# Altium schematic sheet Asfaloth_L2_AVI_ver0.0.SchDoc
size A3
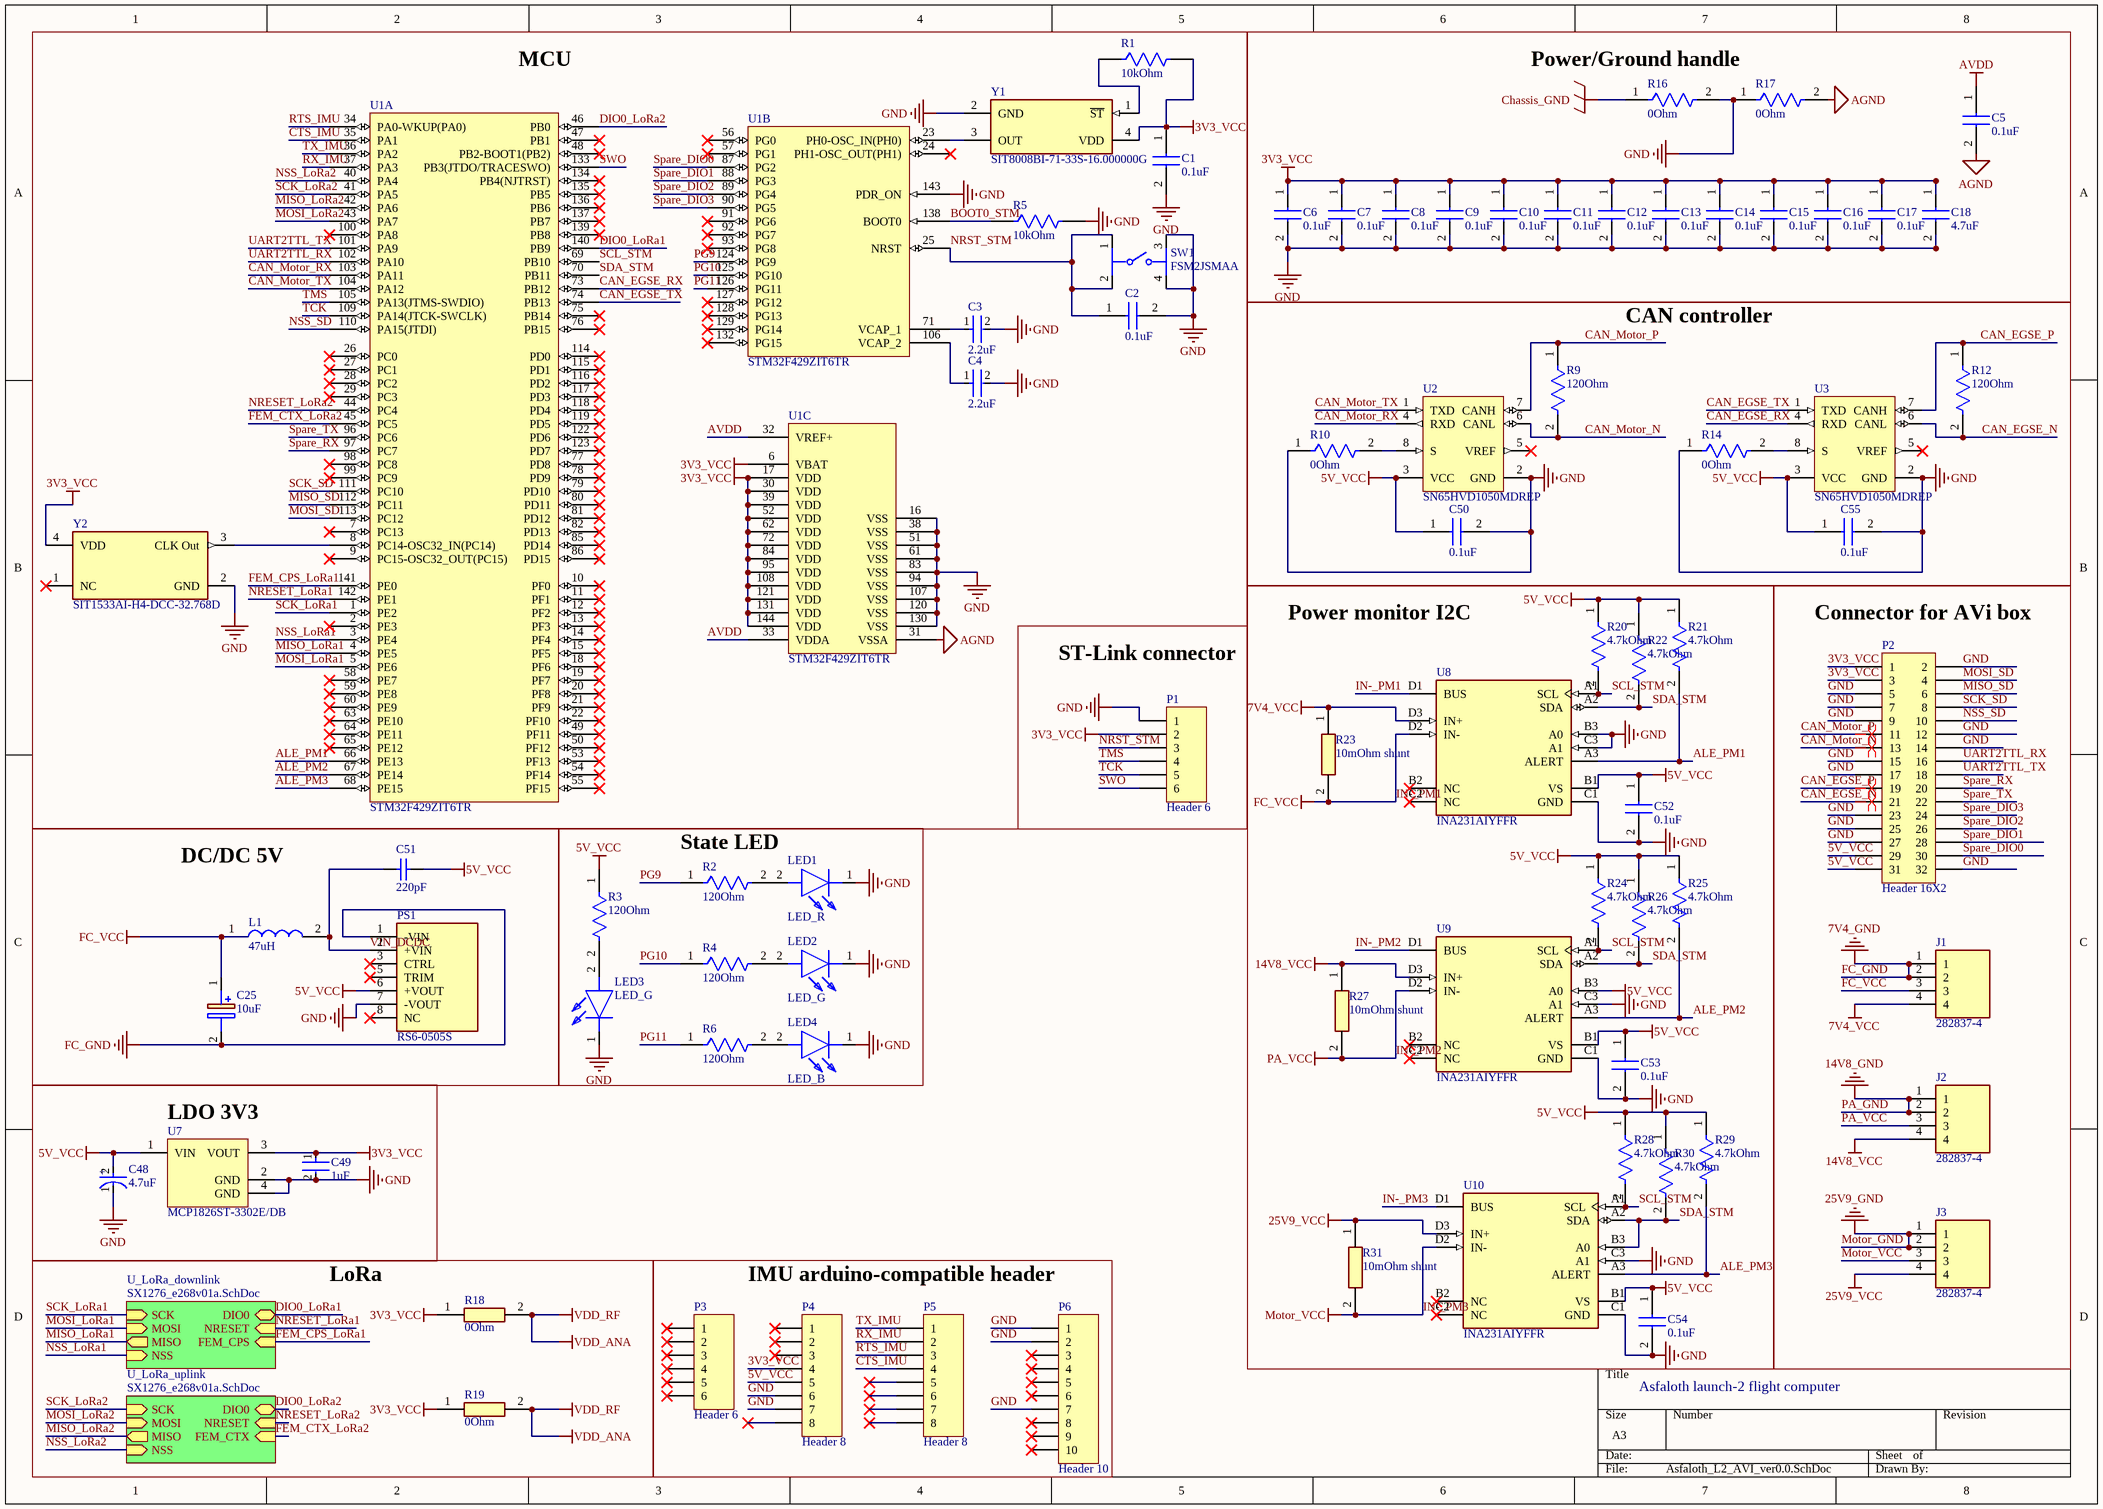
[diagram p0: Asfaloth_L2_AVI_ver0.0.SchDoc]

## Parts
C1  0.1uF  [CAPC1608X87N]
C2  0.1uF  [CAPC1608X87N]
C3  2.2uF  [FP-GRT155-0_2-IPC_C]
C4  2.2uF  [FP-GRT155-0_2-IPC_C]
C5  0.1uF  [CAPC1608X87N]
C6  0.1uF  [CAPC1608X87N]
C7  0.1uF  [CAPC1608X87N]
C8  0.1uF  [CAPC1608X87N]
C9  0.1uF  [CAPC1608X87N]
C10  0.1uF  [CAPC1608X87N]
C11  0.1uF  [CAPC1608X87N]
C12  0.1uF  [CAPC1608X87N]
C13  0.1uF  [CAPC1608X87N]
C14  0.1uF  [CAPC1608X87N]
C15  0.1uF  [CAPC1608X87N]
C16  0.1uF  [CAPC1608X87N]
C17  0.1uF  [CAPC1608X87N]
C18  4.7uF  [GRT188]
C25  10uF  [CAPAE830X650N]
C48  4.7uF  [FP-TAJA-MFG]
C49  1uF  [FP-GCM21B-0_15-MFG]
C50  0.1uF  [CAPC1608X87N]
C51  220pF  [CAPC1608X87X35LL15T15]
C52  0.1uF  [CAPC1608X87N]
C53  0.1uF  [CAPC1608X87N]
C54  0.1uF  [CAPC1608X87N]
C55  0.1uF  [CAPC1608X87N]
J1  282837-4  [2828374]
J2  282837-4  [2828374]
J3  282837-4  [2828374]
L1  47uH  [SRR5228A]
LED1  LED_R  [LEDC2012X80N]
LED2  LED_G  [LEDC2012X90N]
LED3  LED_G  [LEDC2012X90N]
LED4  LED_B  [LEDM2012X100N]
P1  Header 6  [HDR1X6]
P2  Header 16X2  [HDR2X16]
P3  Header 6  [HDR1X6]
P4  Header 8  [HDR1X8]
P5  Header 8  [HDR1X8]
P6  Header 10  [HDR1X10]
PS1  RS6-0505S  [RS60505S]
R1  10kOhm  [FP-CRCW0805-e3-IPC_A]
R2  120Ohm  [FP-ERJ2RK-MFG]
R3  120Ohm  [FP-ERJ2RK-MFG]
R4  120Ohm  [FP-ERJ2RK-MFG]
R5  10kOhm  [FP-CRCW0805-e3-IPC_A]
R6  120Ohm  [FP-ERJ2RK-MFG]
R9  120Ohm  [FP-ERJ2RK-MFG]
R10  0Ohm  [FP-AC0603-0_55-IPC_A]
R12  120Ohm  [FP-ERJ2RK-MFG]
R14  0Ohm  [FP-AC0603-0_55-IPC_A]
R16  0Ohm  [FP-AC0603-0_55-IPC_A]
R17  0Ohm  [FP-AC0603-0_55-IPC_A]
R18  0Ohm  [RESC3216X60N]
R19  0Ohm  [RESC3216X60N]
R20  4.7kOhm  [FP-KTR03-IPC_C]
R21  4.7kOhm  [FP-KTR03-IPC_C]
R22  4.7kOhm  [FP-KTR03-IPC_C]
R23  10mOhm shunt  [CSS0805FT10L0]
R24  4.7kOhm  [FP-KTR03-IPC_C]
R25  4.7kOhm  [FP-KTR03-IPC_C]
R26  4.7kOhm  [FP-KTR03-IPC_C]
R27  10mOhm shunt  [CSS0805FT10L0]
R28  4.7kOhm  [FP-KTR03-IPC_C]
R29  4.7kOhm  [FP-KTR03-IPC_C]
R30  4.7kOhm  [FP-KTR03-IPC_C]
R31  10mOhm shunt  [CSS0805FT10L0]
SW1  FSM2JSMAA  [FP-FSM2JSMAA-MFG]
U1  STM32F429ZIT6TR  [STM-LQFP144_M]  (parts A,B,C of 3)
U2  SN65HVD1050MDREP  [D0008A_M]
U3  SN65HVD1050MDREP  [D0008A_M]
U7  MCP1826ST-3302E/DB  [SOT-223-DB3_L]
U8  INA231AIYFFR  [FP-YFF0012-IPC_C]
U9  INA231AIYFFR  [FP-YFF0012-IPC_C]
U10  INA231AIYFFR  [FP-YFF0012-IPC_C]
Y1  SIT8008BI-71-33S-16.000000G  [FP-SiT8008-7-MFG]
Y2  SIT1533AI-H4-DCC-32.768D  [FP-SiT1533-H-MFG]

## Blocks framed on the sheet
MCU: C1-C4 R1 R5 SW1 U1 Y1 Y2
Power/Ground handle: C5-C18 R16 R17
CAN controller: C50 C55 R9 R10 R12 R14 U2 U3
Power monitor I2C: C52-C54 R20-R31 U8-U10
Connector for AVi box: J1-J3 P2
ST-Link connector: P1
DC/DC 5V: C25 C51 L1 PS1
State LED: LED1-LED4 R2-R4 R6
LDO 3V3: C48 C49 U7
LoRa: R18 R19
IMU arduino-compatible header: P3-P6

## Sub-sheets
U_LoRa_downlink = SX1276_e268v01a.SchDoc: SCK (in), MOSI (in), MISO (out), NSS (in), DIO0 (bidir), NRESET (in), FEM_CPS (in)
U_LoRa_uplink = SX1276_e268v01a.SchDoc: SCK (in), MOSI (in), MISO (out), NSS (in), DIO0 (bidir), NRESET (in), FEM_CTX (in)

## Nets
3V3_VCC: C1.1 C6.1 C7.1 C8.1 C9.1 C10.1 C11.1 C12.1 C13.1 C14.1 C15.1 C16.1 C17.1 C18.1 C49.1 P1.2 P2.1 P2.3 P4.4 R1.2 R18.1 R19.1 U1.6(VBAT) U1.17(VDD) U1.30(VDD) U1.39(VDD) U1.52(VDD) U1.62(VDD) U1.72(VDD) U1.84(VDD) U1.95(VDD) U1.108(VDD) U1.121(VDD) U1.131(VDD) U1.144(VDD) U7.3(VOUT) Y1.4(VDD) Y2.4(VDD)
5V_VCC: C48.2(A) C50.1 C51.2 C52.1 C53.1 C54.1 C55.1 P2.29 P2.31 P4.5 PS1.6(+VOUT) R3.1 R20.1 R21.1 R22.1 R24.1 R25.1 R26.1 R28.1 R29.1 R30.1 U2.3(VCC) U3.3(VCC) U7.1(VIN) U8.B1(VS) U9.B1(VS) U9.B3(A0) U10.B1(VS)
7V4_VCC: J1.4 R23.1 U8.D3(IN+)
14V8_VCC: J2.4 R27.1 U9.D3(IN+)
25V9_VCC: J3.4 R31.1 U10.D3(IN+)
AGND: C5.2 R17.2 U1.31(VSSA)
AVDD: C5.1 U1.32(VREF+) U1.33(VDDA)
Chassis_GND: R16.1
FC_GND: C25.2(-) J1.1 J1.2 PS1.1(-VIN)  [also labelled 7V4_GND]
FC_VCC: C25.1(+) J1.3 L1.1 R23.2 U8.D1(BUS) U8.D2(IN-)  [also labelled IN-_PM1]
GND: C1.2 C2.2 C3.2 C4.2 C6.2 C7.2 C8.2 C9.2 C10.2 C11.2 C12.2 C13.2 C14.2 C15.2 C16.2 C17.2 C18.2 C48.1(C) C49.2 C50.2 C52.2 C53.2 C54.2 C55.2 LED1.1(K) LED2.1(K) LED3.1(K) LED4.1(K) P1.1 P2.2 P2.5 P2.7 P2.9 P2.12 P2.14 P2.15 P2.17 P2.23 P2.25 P2.27 P2.32 P4.6 P4.7 P6.1 P6.2 P6.7 PS1.7(-VOUT) R5.2 R10.1 R14.1 R16.2 R17.1 SW1.3 SW1.4 U1.16(VSS) U1.38(VSS) U1.51(VSS) U1.61(VSS) U1.83(VSS) U1.94(VSS) U1.107(VSS) U1.120(VSS) U1.130(VSS) U1.143(PDR_ON) U2.2(GND) U3.2(GND) U7.2(GND) U7.4(GND) U8.B3(A0) U8.C1(GND) U8.C3(A1) U9.C1(GND) U9.C3(A1) U10.C1(GND) U10.C3(A1) Y1.2(GND) Y2.2(GND)
IN-_PM2: J2.3 R27.2 U9.D1(BUS) U9.D2(IN-)  [also labelled PA_VCC]
IN-_PM3: J3.3 R31.2 U10.D1(BUS) U10.D2(IN-)  [also labelled Motor_VCC]
Motor_GND: J3.1 J3.2  [also labelled 25V9_GND]
PA_GND: J2.1 J2.2  [also labelled 14V8_GND]
VDD_ANA: R18.2 R19.2  [also labelled VDD_RF]
ALE_PM1: R21.2 U1.66(PE13) U8.A3(ALERT)
ALE_PM2: R25.2 U1.67(PE14) U9.A3(ALERT)
ALE_PM3: R29.2 U1.68(PE15) U10.A3(ALERT)
BOOT0_STM: R5.1 U1.138(BOOT0)
CAN_EGSE_N: P2.21 R12.2 U3.6(CANL)
CAN_EGSE_P: P2.19 R12.1 U3.7(CANH)
CAN_EGSE_RX: U1.73(PB12) U3.4(RXD)
CAN_EGSE_TX: U1.74(PB13) U3.1(TXD)
CAN_Motor_N: P2.13 R9.2 U2.6(CANL)
CAN_Motor_P: P2.11 R9.1 U2.7(CANH)
CAN_Motor_RX: U1.103(PA11) U2.4(RXD)
CAN_Motor_TX: U1.104(PA12) U2.1(TXD)
CTS_IMU: P5.4 U1.35(PA1)
DIO0_LoRa1: U1.140(PB9) ; sheet U_LoRa_downlink/DIO0
DIO0_LoRa2: U1.46(PB0) ; sheet U_LoRa_uplink/DIO0
FEM_CPS_LoRa1: U1.141(PE0) ; sheet U_LoRa_downlink/FEM_CPS
FEM_CTX_LoRa2: U1.45(PC5) ; sheet U_LoRa_uplink/FEM_CTX
MISO_LoRa1: U1.4(PE5) ; sheet U_LoRa_downlink/MISO
MISO_LoRa2: U1.42(PA6) ; sheet U_LoRa_uplink/MISO
MISO_SD: P2.6 U1.112(PC11)
MOSI_LoRa1: U1.5(PE6) ; sheet U_LoRa_downlink/MOSI
MOSI_LoRa2: U1.43(PA7) ; sheet U_LoRa_uplink/MOSI
MOSI_SD: P2.4 U1.113(PC12)
NRESET_LoRa1: U1.142(PE1) ; sheet U_LoRa_downlink/NRESET
NRESET_LoRa2: U1.44(PC4) ; sheet U_LoRa_uplink/NRESET
NRST_STM: C2.1 P1.3 SW1.1 SW1.2 U1.25(NRST)
NSS_LoRa1: U1.3(PE4) ; sheet U_LoRa_downlink/NSS
NSS_LoRa2: U1.40(PA4) ; sheet U_LoRa_uplink/NSS
NSS_SD: P2.10 U1.110(PA15(JTDI))
PG9: R2.1 U1.124(PG9)
PG10: R4.1 U1.125(PG10)
PG11: R6.1 U1.126(PG11)
RTS_IMU: P5.3 U1.34(PA0-WKUP(PA0))
RX_IMU: P5.2 U1.37(PA3)
SCK_LoRa1: U1.1(PE2) ; sheet U_LoRa_downlink/SCK
SCK_LoRa2: U1.41(PA5) ; sheet U_LoRa_uplink/SCK
SCK_SD: P2.8 U1.111(PC10)
SCL_STM: R20.2 R24.2 R28.2 U1.69(PB10) U8.A1(SCL) U9.A1(SCL) U10.A1(SCL)
SDA_STM: R22.2 R26.2 R30.2 U1.70(PB11) U8.A2(SDA) U9.A2(SDA) U10.A2(SDA) U10.B3(A0)
Spare_DIO0: P2.30 U1.87(PG2)
Spare_DIO1: P2.28 U1.88(PG3)
Spare_DIO2: P2.26 U1.89(PG4)
Spare_DIO3: P2.24 U1.90(PG5)
Spare_RX: P2.20 U1.97(PC7)
Spare_TX: P2.22 U1.96(PC6)
SWO: P1.6 U1.133(PB3(JTDO/TRACESWO))
TCK: P1.5 U1.109(PA14(JTCK-SWCLK))
TMS: P1.4 U1.105(PA13(JTMS-SWDIO))
TX_IMU: P5.1 U1.36(PA2)
UART2TTL_RX: P2.16 U1.102(PA10)
UART2TTL_TX: P2.18 U1.101(PA9)
VIN_DCDC: C51.1 L1.2 PS1.2(+VIN)
NetC3_1: C3.1 U1.71(VCAP_1)
NetC4_1: C4.1 U1.106(VCAP_2)
NetLED1_2: LED1.2(A) R2.2
NetLED2_2: LED2.2(A) R4.2
NetLED3_2: LED3.2(A) R3.2
NetLED4_2: LED4.2(A) R6.2
NetR1_1: R1.1 Y1.1(~{ST})
NetR10_2: R10.2 U2.8(S)
NetR14_2: R14.2 U3.8(S)
NetU1_8: U1.8(PC14-OSC32_IN(PC14)) Y2.3(CLK_Out)
NetU1_23: U1.23(PH0-OSC_IN(PH0)) Y1.3(OUT)

Not connected (* = marked no-connect by the designer): P3 1* 2* 3* 4* 5* 6*; P4 1* 2* 3* 8*; P5 5* 6* 7* 8*; P6 3* 4* 5* 6* 8* 9* 10*; PS1 3(CTRL)* 5(TRIM)* 8(NC)*; U1 2(PE3)* 7(PC13)* 9(PC15-OSC32_OUT(PC15))* 10(PF0)* 11(PF1)* 12(PF2)* 13(PF3)* 14(PF4)* 15(PF5)* 18(PF6)* 19(PF7)* 20(PF8)* 21(PF9)* 22(PF10)* 24(PH1-OSC_OUT(PH1))* 26(PC0)* 27(PC1)* 28(PC2)* 29(PC3)* 47(PB1)* 48(PB2-BOOT1(PB2))* 49(PF11)* 50(PF12)* 53(PF13)* 54(PF14)* 55(PF15)* 56(PG0)* 57(PG1)* 58(PE7)* 59(PE8)* 60(PE9)* 63(PE10)* 64(PE11)* 65(PE12)* 75(PB14)* 76(PB15)* 77(PD8)* 78(PD9)* 79(PD10)* 80(PD11)* 81(PD12)* 82(PD13)* 85(PD14)* 86(PD15)* 91(PG6)* 92(PG7)* 93(PG8)* 98(PC8)* 99(PC9)* 100(PA8)* 114(PD0)* 115(PD1)* 116(PD2)* 117(PD3)* 118(PD4)* 119(PD5)* 122(PD6)* 123(PD7)* 127(PG12)* 128(PG13)* 129(PG14)* 132(PG15)* 134(PB4(NJTRST))* 135(PB5)* 136(PB6)* 137(PB7)* 139(PB8)*; U2 5(VREF)*; U3 5(VREF)*; U8 B2(NC)* C2(NC)*; U9 B2(NC)* C2(NC)*; U10 B2(NC)* C2(NC)*; Y2 1(NC)*

## Layout directives
differential pair: CAN_EGSE_N, CAN_EGSE_P, CAN_Motor_N, CAN_Motor_P

## Notes on the sheet
- Asfaloth launch-2 flight computer
- (in symbol CMP-2100-03687-2) +

## Library data of the parts
C1 C2 C5-C17 C50 C52-C55 = C0603C104J4RECAUTO: Capacitor; Manufacturer_Name: KEMET; Datasheet Link: https://content.kemet.com/datasheets/KEM_C1090_X7R_ESD.pdf; Height: 0.87mm; Manufacturer_Part_Number: C0603C104J4RECAUTO; Mouser Part Number: 80-C0603C104J4RECAUT; Mouser Price/Stock: https://www.mouser.co.uk/ProductDetail/KEMET/C0603C104J4RECAUTO?qs=MLItCLRbWswpTgrKtA5UXg%3D%3D
C3 C4 = CMP-06035-008228-1: Multi-Layer Ceramic Capacitor 2.2uF 10V X6S ±10% 0402 Paper T/R; Case Code (Imperial): 0402; Max Operating Temperature: 105°C; Width: 0.02inch; Thickness: 0.022inch; Ratings: AEC-Q200; Mount: Surface Mount; Voltage Rating (DC): 10V; Capacitance: 2.2uF; Voltage Rating: 10V; Dielectric: X6S; Packaging: Tape and Reel; Case/Package: 0402; Case Code (Metric): 1005; Tolerance: 10%; Min Operating Temperature: -55°C; Length: 0.039inch
C18 = GRT188C71C475KE13D: Capacitor; Manufacturer_Name: Murata Electronics; Datasheet Link: https://www.murata.com/en-global/products/productdetail?partno=GRT188C71C475KE13%23; Height: 0.8mm; Manufacturer_Part_Number: GRT188C71C475KE13D; Mouser Part Number: 81-GRT188C71C475KE13; Mouser Price/Stock: https://www.mouser.co.uk/ProductDetail/Murata-Electronics/GRT188C71C475KE13D?qs=pUKx8fyJudC7lYX%252BQNKS7Q%3D%3D; Arrow Part Number: GRT188C71C475KE13D; Arrow Price/Stock: https://www.arrow.com/en/products/grt188c71c475ke13d/murata-manufacturing?region=nac
C25 = EEE-TG1J100P: Capacitor Polarised; Manufacturer_Name: Panasonic; Datasheet Link: http://industrial.panasonic.com/cdbs/www-data/pdf/RDE0000/ABA0000C1187.pdf; Height: 6.5mm; Manufacturer_Part_Number: EEE-TG1J100P; Mouser Part Number: 667-EEE-TG1J100P; Mouser Price/Stock: https://www.mouser.co.uk/ProductDetail/Panasonic/EEE-TG1J100P?qs=aAAGLDy8P2x3htHP%2FTxLDQ%3D%3D; Arrow Part Number: EEE-TG1J100P; Arrow Price/Stock: https://www.arrow.com/en/products/eee-tg1j100p/panasonic; Supplier 1: Mouser; Supplier Part Number 1: 667-EEE-TG1J100P
C48 = CMP-2100-03687-2: 4.7uF 16V  ±10% 4Ω 1206  SMD Tantalum Capacitor; Leakage Current: 800nA; ESR (Equivalent Series Resistance): 4R; Dissipation Factor: 6%; Polarity: Polar; Number of Pins: 2; Case Code (Metric): 3216; Dielectric Material: Tantalum; REACH SVHC: No SVHC; Height: 1.6mm; Lead Pitch: 1.1mm; Tolerance: 10%; Voltage Rating (DC): 16V; Features: General Purpose; Case Code (Imperial): 1206; Packaging: Tape and Reel; Termination: SMD/SMT; Capacitance: 4.7uF; Voltage: 16V; Case/Package: 1206; Length: 3.2mm; Max Operating Temperature: 125°C; Depth: 1.6mm; Height - Seated (Max): 0.071inch; Series: TAJ; Mount: Surface Mount; Package Quantity: 1; Radiation Hardening: No; Voltage Rating: 16V; Min Operating Temperature: -55°C; Lead Free: Lead Free; RoHS Compliant: Yes; Width: 1.6mm; Construction: Flat
C49 = CMP-06035-047787-1: Ceramic Capacitor for Automotive 1uF ±10% 16VDC X7R 0805 Embossed T/R; Voltage Rating (DC): 16V; Capacitance: 1uF; Case/Package: 0805; Dielectric: X7R; Depth: 1.25mm; Min Operating Temperature: -55°C; Max Operating Temperature: 125°C; Packaging: Tape and Reel; Length: 2mm; Tolerance: 10%
C51 = CMP-2006-03337-1: Part Number: C0603C221J5GACAUTO; Manufacturer: Kemet
J1-J3 = 282837-4: Connector; Manufacturer_Name: TE Connectivity; Datasheet Link: https://www.te.com/commerce/DocumentDelivery/DDEController?Action=srchrtrv&DocNm=1-1773458-1_EURO_STYLE_QRG&DocType=Data%20Sheet&DocLang=English&PartCntxt=282837-4&DocFormat=pdf; Height: 10.3mm; Manufacturer_Part_Number: 282837-4; Mouser Part Number: 571-2828374; Mouser Price/Stock: https://www.mouser.co.uk/ProductDetail/TE-Connectivity/282837-4?qs=A%252Bip%252BNCYi6MiQzbqNH27Ug%3D%3D; Arrow Part Number: 282837-4; Arrow Price/Stock: https://www.arrow.com/en/products/282837-4/te-connectivity?region=nac
L1 = SRR5228A-470M: Inductor; Manufacturer_Name: Bourns; Datasheet Link: https://www.bourns.com/docs/Product-Datasheets/SRR5228A.pdf; Manufacturer_Part_Number: SRR5228A-470M; Mouser Part Number: 6521-SRR5228A-470M; Mouser Price/Stock: https://www.mouser.co.uk/ProductDetail/Bourns/SRR5228A-470M?qs=QpmGXVUTftG9kA8o879uEQ%3D%3D; Supplier 1: Mouser; Supplier Part Number 1: 6521-SRR5228A-470M
LED1 = SML-H12V8TT86C: LED; Manufacturer_Name: ROHM Semiconductor; Datasheet Link: https://www.mouser.in/ProductDetail/ROHM-Semiconductor/SML-H12V8TT86C?qs=HXFqYaX1Q2xM3o6aiCqz5g%3D%3D; Height: 0.8mm; Manufacturer_Part_Number: SML-H12V8TT86C; Mouser Part Number: 755-SML-H12V8TT86C; Mouser Price/Stock: https://www.mouser.co.uk/ProductDetail/ROHM-Semiconductor/SML-H12V8TT86C?qs=HXFqYaX1Q2xM3o6aiCqz5g%3D%3D
LED2 LED3 = SML-H12P8TT86C: LED; Manufacturer_Name: ROHM Semiconductor; Datasheet Link: https://mouser.componentsearchengine.com/Datasheets/2/SML-H12P8TT86C.pdf; Height: 0.9mm; Manufacturer_Part_Number: SML-H12P8TT86C; Mouser Part Number: 755-SML-H12P8TT86C; Mouser Price/Stock: https://www.mouser.co.uk/ProductDetail/ROHM-Semiconductor/SML-H12P8TT86C?qs=HXFqYaX1Q2xINkpk%2F8IQZg%3D%3D
LED4 = SMLMN2BCTT86C: LED; Manufacturer_Name: ROHM Semiconductor; Datasheet Link: https://fscdn.rohm.com/en/products/databook/datasheet/opto/led/chip_mono/smlmn2bctt86(c)-e.pdf; Height: 1mm; Manufacturer_Part_Number: SMLMN2BCTT86C; Mouser Part Number: 755-SMLMN2BCTT86C; Mouser Price/Stock: https://www.mouser.co.uk/ProductDetail/ROHM-Semiconductor/SMLMN2BCTT86C?qs=EAJhGnHnT02MwYNfU4gt9w%3D%3D; Arrow Part Number: SMLMN2BCTT86C; Arrow Price/Stock: https://www.arrow.com/en/products/smlmn2bctt86c/rohm-semiconductor
P1 P3 = Header 6: Header, 6-Pin; LatestRevisionDate: 17-Jul-2002; LatestRevisionNote: Re-released for DXP Platform.; Publisher: Altium Limited
P2 = Header 16X2: Header, 16-Pin, Dual row; LatestRevisionDate: 17-Jul-2002; LatestRevisionNote: Re-released for DXP Platform.; Publisher: Altium Limited
P4 P5 = Header 8: Header, 8-Pin; LatestRevisionDate: 17-Jul-2002; LatestRevisionNote: Re-released for DXP Platform.; Publisher: Altium Limited
P6 = Header 10: Header, 10-Pin; LatestRevisionDate: 17-Jul-2002; LatestRevisionNote: Re-released for DXP Platform.; Publisher: Altium Limited
PS1 = RS6-0505S: Power Supply; Manufacturer_Name: RECOM Power; Datasheet Link: https://www.recom-power.com/pdf/Econoline/RS6.pdf; Height: 11.6mm; Manufacturer_Part_Number: RS6-0505S; Mouser Part Number: 919-RS6-0505S; Mouser Price/Stock: https://www.mouser.co.uk/ProductDetail/RECOM-Power/RS6-0505S?qs=FLBwGrBR9%252B3r5kgbzQWtZg%3D%3D; Arrow Part Number: RS6-0505S; Arrow Price/Stock: https://www.arrow.com/en/products/rs6-0505s/recom-power?region=nac; Supplier 1: Mouser; Supplier Part Number 1: 919-RS6-0505S
R1 R5 = CMP-2001-04908-2: RES Thick Film, 10kΩ, 1%, 0.125W, 100ppm/°C, 0805; Resistance: 10kR; Voltage Rating (DC): 150V; Power Rating: 125mW; Weight: 0.000194oz; Package Quantity: 5000; Military Standard: Not; Max Operating Temperature: 155°C; Temperature Coefficient: 100ppm/°C; Contact Plating: Tin; Width: 1.25mm; Height: 0.45mm; Radiation Hardening: No; Tolerance: 1%; Min Operating Temperature: -55°C; Voltage Rating: 150V; Length: 2mm; Depth: 1.25mm; Termination: SMD/SMT; Packaging: Tape and Reel; Case/Package: 0805; Case Code (Metric): 2012; Lead Free: Lead Free; Case Code (Imperial): 0805; Composition: Thick Film
R2-R4 R6 R9 R12 = CMP-2002-00645-2: RES SMD 120 OHM 1% 1/10W 0402; Resistance: 120R; Voltage Rating (DC): 50V; Temperature Coefficient: 100ppm/°C; Power Rating: 100mW; Case Code (Imperial): 0402; Military Standard: Not; Width: 0.5mm; Technology: THICK FILM; Case Code (Metric): 1005; Lead Free: Lead Free; Radiation Hardening: No; Termination: SMD/SMT; Weight: 0.000388oz; Case/Package: 0402; Resistor Type: Thick Film; Number of Pins: 2; Package Quantity: 10000; Tolerance: 1%; Depth: 0.5mm; RoHS Compliant: Yes; Min Operating Temperature: -55°C; Max Operating Temperature: 155°C; Length: 1mm; Series: ERJ-2Rx; Height: 0.35mm; Mount: Surface Mount; Number of Terminations: 2; Features: Automotive AEC-Q200; Contact Plating: Tin; Voltage Rating: 50V; Max Power Dissipation: 100mW; Packaging: Cut Tape; REACH SVHC: No SVHC
R10 R14 R16 R17 = CMP-2000-04815-2: RES SMD 0 OHM JUMPER 1/10W 0603; Power Rating: 100mW; Tolerance: 1%; Voltage Rating: 50V; Resistance: 0R; Temperature Coefficient: 200ppm/°C; Min Operating Temperature: -55°C; Case Code (Imperial): 0603; Size Code: 0603; Termination: SMD/SMT; Lead Free: Lead Free; Package Quantity: 1; Max Power Dissipation: 100mW; Packaging: Tape and Reel; Series: AC; Case Code (Metric): 1608; Height: 0.022inch; Length: 0.063inch; Case/Package: 0603; Resistor Type: Thick Film; Max Operating Temperature: 155°C; Features: Moisture Resistant; Width: 0.031inch; Number of Terminations: 2
R18 R19 = RCA12060000ZSEA: Resistor; Manufacturer_Name: Vishay; Datasheet Link: https://www.mouser.in/datasheet/2/427/rcae3-1761931.pdf; Height: 0.6mm; Manufacturer_Part_Number: RCA12060000ZSEA; Mouser Part Number: 71-RCA12060000ZSEA; Mouser Price/Stock: https://www.mouser.co.uk/ProductDetail/Vishay-Draloric/RCA12060000ZSEA?qs=4%252Ber4tcBTOgzMfDdqtZgmA%3D%3D; Arrow Part Number: RCA12060000ZSEA; Arrow Price/Stock: https://www.arrow.com/en/products/rca12060000zsea/vishay?region=nac
R20-R22 R24-R26 R28-R30 = CMP-08839-030274-1: Res Thick Film 0603 4.7kΩ 5% 0.1W ±200ppm/°C Automotive Paper T/R; Max Power Dissipation: 100mW; Resistance: 4.7kR; Width: 0.031inch; Series: KTR03; Number of Terminations: 2; RoHS Compliant: Yes; Package Quantity: 5000; Min Operating Temperature: -55°C; Height: 0.022inch; Length: 0.063inch; Resistor Type: Thick Film; Tolerance: 5%; Case/Package: 0603; Temperature Coefficient: 200ppm/°C; Max Operating Temperature: 155°C; Packaging: Tape and Reel
R23 R27 R31 = CSS0805FT10L0: Resistor; Manufacturer_Name: Stackpole Electronics; Datasheet Link: https://cs.seielect.com/catalog/SEI-CSS_CSSH.PDF; Height: 0.65mm; Manufacturer_Part_Number: CSS0805FT10L0; Mouser Part Number: 708-CSS0805FT10L0; Mouser Price/Stock: https://www.mouser.co.uk/ProductDetail/SEI-Stackpole/CSS0805FT10L0?qs=IPgv5n7u5QYApC%252BwHqTVbQ%3D%3D
SW1 = CMP-03402-000003-1: SWITCH TACTILE SPST-NO 0.05A 24V; Manufacturer: TE Connectivity; Standoff Height: 0.05mm; Contact Current Rating: 50mA; Electromechanical Life: 100000Cycles; Operating Force: 260gf; Contact Resistance: 100mΩ; Package: 0; Temperature Range High: +85°C; Temperature: -35°C to +85°C; Category: Switch; Manufacturer Part Number: FSM2JSMAA; RoHS: TRUE; Mouser Description: Tactile Switches TACTILE 260G FORCE S; Device Class L1: Electromechanical; Mount: Surface Mount; Height: 4.59mm; ComponentLink2URL: https://www.te.com/commerce/DocumentDelivery/DDEController?Action=showdoc&DocId=Customer+Drawing%7F2-1437565-7%7FV%7Fpdf%7FEnglish%7FENG_CD_2-1437565-7_V.pdf%7F2-1437565-8; Temperature Range Low: -35°C; Voltage Rating Dc: 24V; Lead Free: Yes; Automotive: No; Throw Configuration: SPST-NO; Octopart: https://octopart.com/fsm2jsmaa-te+connectivity-41720620; Device Class L2: Switches; Device Class L3: Pushbutton Switches; ComponentLink2Description: Datasheet; Digikey Description: SWITCH TACTILE SPST-NO 0.05A 24V
U1 = CMP-0243-00201-1: ARM Cortex-M4 32-bit MCU+FPU, 2048 KB Flash, 256 KB Internal RAM, 114 I/Os, 144-Pin LQFP, -40 to 85 degC, Tape and Reel; FLASH Size (Prog) (kB): 2048; D/A Converter: 2; I/Os (High Current): 114; Internal RAM Size (kB): 256; Supply Voltage(Vcc) min (V): 1.7; Operating Frequency(F) (Processor speed) (MHz): 180; ComponentLink2URL: http://www.st.com/st-web-ui/static/active/en/resource/technical/document/datasheet/DM00071990.pdf; Package Reference: 144-Pin Low Profile Quad Flat Package, Body 20 x 20 mm, Pitch 0.5 mm; ComponentLink2Description: Datasheet; Mounting Technology: Surface Mount; DatasheetVersion: Rev. 7; ComponentLink1URL: http://www.st.com/; Package Description: LQFP144; ComponentLink1Description: Manufacturer URL; Packing: Tape and Reel; Core: ARM Cortex-M4
U2 U3 = CMP-0315-00066-2: Enhanced Product Emc Optimized Can Transceiver, 70 mA, -55 to 125 degC, 8-pin SOIC (D), Green (RoHS & no Sb/Br); Manufacturer: Texas Instruments; Rating: HiRel Enhanced Product; Receivers Per Package: 1; ICC(Max)(mA): 10, 70, 10; ComponentLink1URL: http://www.ti.com/general/docs/lit/getliterature.tsp?genericPartNumber=SN65HVD1050-EP&fileType=pdf; ComponentLink1Description: Datasheet; PartNumber: SN65HVD1050MDREP; PackageDescription: 8-Pin Plastic Small Outline Integrated Circuit, 4.9 x 3.9 mm, Pitch 1.27 mm Pitch; Drivers Per Package: 1; Isolated: No; Eco-Plan: Green (RoHS & no Sb/Br); PackageVersion: revM, Jun-2011; Code_JEDEC: MS-012AA; Mounting Technology: Surface Mount; PackageReference: D0008A; DatasheetVersion: SLLS772A; SubFamily: CAN
U7 = CMP-0136-00497-1: 1000 mA, Low Voltage, Low Quiescent Current LDO Regulator, 3-Pin SOT-223, Extended Temperature, Tape and Reel; PackageVersion: revBB, Aug-2009; PackageDescription: 3-Lead Plastic Small Outline Transistor (DB) [SOT-223]; DatasheetVersion: revA, Aug-2007; PackageReference: SOT-223-DB3
U8-U10 = CMP-04910-000108-1: IC CURRENT MONITOR 100DB 12DSBGA; Min Supply Voltage: 2.7V; Accuracy: 0.5%; Nominal Supply Current: 330uA; Max Supply Voltage: 5.5V; Lead Free: Lead Free; Number of Pins: 12; Max Operating Temperature: 125°C; Min Operating Temperature: -40°C; Packaging: Tape and Reel; Radiation Hardening: No; RoHS Compliant: Yes; Mount: Surface Mount; Package Quantity: 3000
Y1 = CMP-25159-264800-1: MEMS OSC XO 16.0000MHZ H/LV-CMOS; Frequency Stability: 20ppm; Max Supply Current: 4.5mA; Frequency: 16MHz; Series: SIT8008B; Mount: Surface Mount; Packaging: Cut Tape; Case/Package: SMD/SMT; Min Operating Temperature: -40°C; Max Operating Temperature: 85°C; RoHS Compliant: Yes
Y2 = CMP-25159-260514-1: MEMS OSC XO 32.7680KHZ LVCMOS; Frequency Stability: 100ppm; Max Supply Current: 1.4uA; Frequency: 32.768kHz; Max Operating Temperature: 85°C; Min Operating Temperature: -40°C; Mount: Surface Mount; Series: SiT1533; Packaging: Cut Tape; RoHS Compliant: Yes; Case/Package: SMD/SMT